# Altium schematic sheet sheet5.SchDoc
size A2
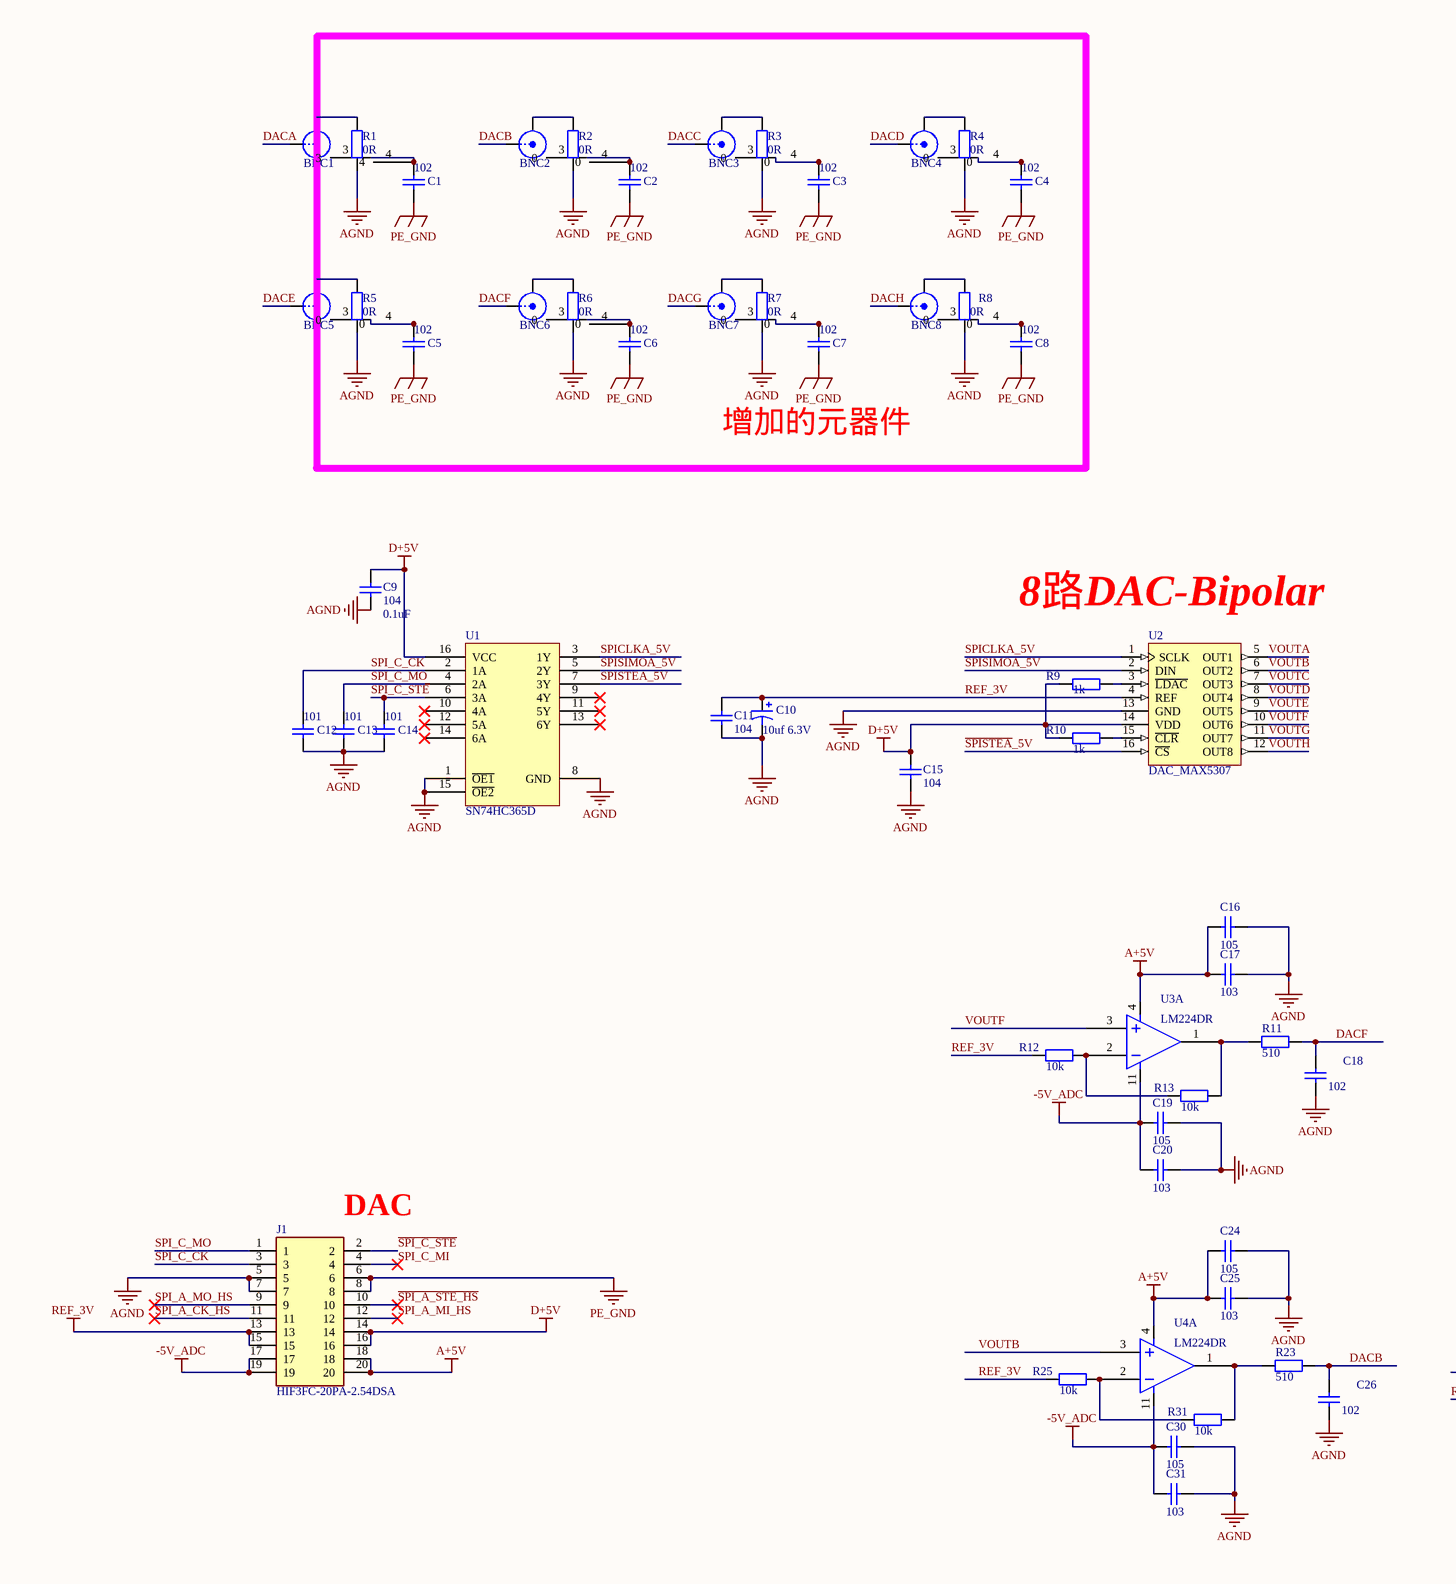
[diagram p0: sheet5.SchDoc, left]
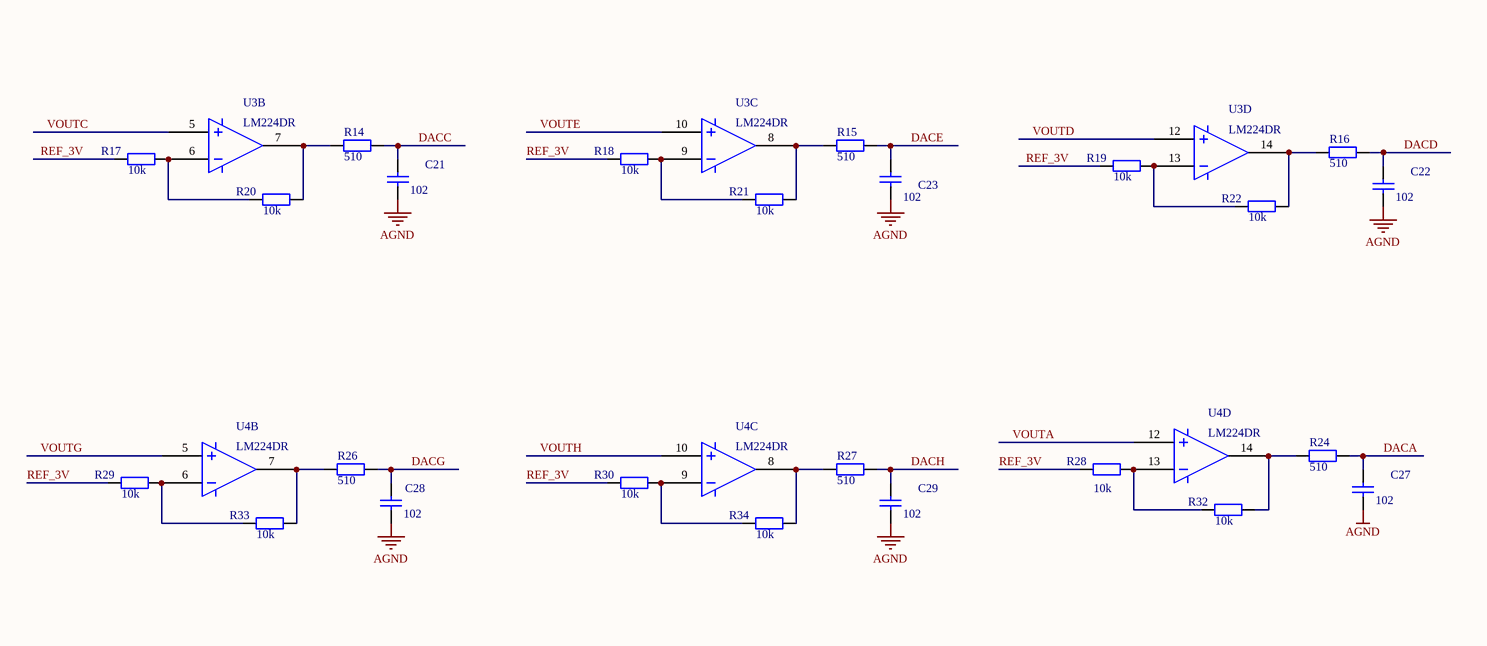
[diagram p1: sheet5.SchDoc, right]

## Parts
BNC1  BNC  [BNC]  (value not drawn)
BNC2  BNC  [BNC]  (value not drawn)
BNC3  BNC  [BNC]  (value not drawn)
BNC4  BNC  [BNC]  (value not drawn)
BNC5  BNC  [BNC]  (value not drawn)
BNC6  BNC  [BNC]  (value not drawn)
BNC7  BNC  [BNC]  (value not drawn)
BNC8  BNC  [BNC]  (value not drawn)
C1  102  [0805]
C2  102  [0805]
C3  102  [0805]
C4  102  [0805]
C5  102  [0805]
C6  102  [0805]
C7  102  [0805]
C8  102  [0805]
C9  104  value 0.1uF  [0805]
C10  10uf 6.3V  [1206 (钽电容)]
C11  104  [0805]
C12  101  [0805]
C13  101  [0805]
C14  101  [0805]
C15  104  [0805]
C16  105  [0805]
C17  103  [0805]
C18  102  [0805]
C19  105  [0805]
C20  103  [0805]
C21  102  [0805]
C22  102  [0805]
C23  102  [0805]
C24  105  [0805]
C25  103  [0805]
C26  102  [0805]
C27  102  [0805]
C28  102  [0805]
C29  102  [0805]
C30  105  [0805]
C31  103  [0805]
J1  HIF3FC-20PA-2.54DSA  [SHDR20W56P254_2X10_3290X850X950P]
R1  0R  [0805]
R2  0R  [0805]
R3  0R  [0805]
R4  0R  [0805]
R5  0R  [0805]
R6  0R  [0805]
R7  0R  [0805]
R8  0R  [0805]
R9  1k  [0805]
R10  1k  [0805]
R11  510  [0805]
R12  10k  [0805]
R13  10k  [0805]
R14  510  [0805]
R15  510  [0805]
R16  510  [0805]
R17  10k  [0805]
R18  10k  [0805]
R19  10k  [0805]
R20  10k  [0805]
R21  10k  [0805]
R22  10k  [0805]
R23  510  [0805]
R24  510  [0805]
R25  10k  [0805]
R26  510  [0805]
R27  510  [0805]
R28  10k  [0805]
R29  10k  [0805]
R30  10k  [0805]
R31  10k  [0805]
R32  10k  [0805]
R33  10k  [0805]
R34  10k  [0805]
U1  SN74HC365D  [D016_N]
U2  DAC_MAX5307  [TSSOP16]
U3  LM224DR  [SOIC14_M]  (parts A,B,C,D of 4)
U4  LM224DR  [SOIC14_M]  (parts A,B,C,D of 4)

## Blocks framed on the sheet
增加的元器件: BNC1-BNC8 C1-C8 R1-R8

## Nets
-5V_ADC: C19.2 C20.1 C30.2 C31.1 J1.17 J1.19 U3.11 U4.11
A+5V: C16.2 C17.1 C24.2 C25.1 J1.18 J1.20 U3.4 U4.4
AGND: C9.2 C10.2 C11.1 C12.2 C13.2 C14.2 C15.1 C16.1 C17.2 C18.2 C19.1 C20.2 C21.2 C22.2 C23.2 C24.1 C25.2 C26.2 C27.2 C28.2 C29.2 C30.1 C31.2 J1.5 J1.7 R1.1 R2.1 R3.1 R4.1 R5.1 R6.1 R7.1 R8.1 U1.1(~{OE1}) U1.8(GND) U1.15(~{OE2}) U2.13(GND)
D+5V: C9.1 C15.2 J1.14 J1.16 R9.1 R10.1 U1.16(VCC) U2.14(VDD)
PE_GND: C1.2 C2.2 C3.2 C4.2 C5.2 C6.2 C7.2 C8.2 J1.6 J1.8
REF_3V: C10.1 C11.2 J1.13 J1.15 R12.1 R17.1 R18.1 R19.1 R25.1 R28.1 R29.1 R30.1 U2.4(REF)
DACA: BNC1.1 C27.1 R24.2
DACB: BNC2.1(X) C26.1 R23.2
DACC: BNC3.1(X) C21.1 R14.2
DACD: BNC4.1(X) C22.1 R16.2
DACE: BNC5.1(X) C23.1 R15.2
DACF: BNC6.1(X) C18.1 R11.2
DACG: BNC7.1(X) C28.1 R26.2
DACH: BNC8.1(X) C29.1 R27.2
~{SPI_A_STE_HS}: J1.10
~{SPI_C_STE}: C14.1 J1.2 U1.6(3A)
~{SPISTEA}_5V: U1.7(3Y) U2.16(~{CS})
SPI_A_CK_HS: J1.11
SPI_A_MI_HS: J1.12
SPI_A_MO_HS: J1.9
SPI_C_CK: C12.1 J1.3 U1.2(1A)
SPI_C_MI: J1.4
SPI_C_MO: C13.1 J1.1 U1.4(2A)
SPICLKA_5V: U1.3(1Y) U2.1(SCLK)
SPISIMOA_5V: U1.5(2Y) U2.2(DIN)
VOUTA: U2.5(OUT1) U4.12
VOUTB: U2.6(OUT2) U4.3
VOUTC: U2.7(OUT3) U3.5
VOUTD: U2.8(OUT4) U3.12
VOUTE: U2.9(OUT5) U3.10
VOUTF: U2.10(OUT6) U3.3
VOUTG: U2.11(OUT7) U4.5
VOUTH: U2.12(OUT8) U4.10
NetBNC1_2: BNC1.2 R1.2
NetBNC1_3: BNC1.3 BNC1.4 C1.1
NetBNC2_2: BNC2.2(Y) R2.2
NetBNC2_3: BNC2.3(0) BNC2.4(0) C2.1
NetBNC3_2: BNC3.2(Y) R3.2
NetBNC3_3: BNC3.3(0) BNC3.4(0) C3.1
NetBNC4_2: BNC4.2(Y) R4.2
NetBNC4_3: BNC4.3(0) BNC4.4(0) C4.1
NetBNC5_2: BNC5.2(Y) R5.2
NetBNC5_3: BNC5.3(0) BNC5.4(0) C5.1
NetBNC6_2: BNC6.2(Y) R6.2
NetBNC6_3: BNC6.3(0) BNC6.4(0) C6.1
NetBNC7_2: BNC7.2(Y) R7.2
NetBNC7_3: BNC7.3(0) BNC7.4(0) C7.1
NetBNC8_2: BNC8.2(Y) R8.2
NetBNC8_3: BNC8.3(0) BNC8.4(0) C8.1
NetR9_2: R9.2 U2.3(~{LDAC})
NetR10_2: R10.2 U2.15(~{CLR})
NetR11_1: R11.1 R13.2 U3.1
NetR12_2: R12.2 R13.1 U3.2
NetR14_1: R14.1 R20.2 U3.7
NetR15_1: R15.1 R21.2 U3.8
NetR16_1: R16.1 R22.2 U3.14
NetR17_2: R17.2 R20.1 U3.6
NetR18_2: R18.2 R21.1 U3.9
NetR19_2: R19.2 R22.1 U3.13
NetR23_1: R23.1 R31.2 U4.1
NetR24_1: R24.1 R32.2 U4.14
NetR25_2: R25.2 R31.1 U4.2
NetR26_1: R26.1 R33.2 U4.7
NetR27_1: R27.1 R34.2 U4.8
NetR28_2: R28.2 R32.1 U4.13
NetR29_2: R29.2 R33.1 U4.6
NetR30_2: R30.2 R34.1 U4.9

Not connected (* = marked no-connect by the designer): U1 9(4Y)* 10(4A)* 11(5Y)* 12(5A)* 13(6Y)* 14(6A)*

## Notes on the sheet
- 8路DAC-Bipolar
- (near J1) DAC

## Library data of the parts
BNC1-BNC8 = BNC: BNC Elbow Connector; LatestRevisionDate: 17-Jul-2002; LatestRevisionNote: Re-released for DXP Platform.; Publisher: Altium Limited
C1-C8 C12-C14 = Cap Semi: Capacitor (Semiconductor SIM Model); Published: 8-Jun-2000; LatestRevisionDate: 17-Jul-2002; LatestRevisionNote: Re-released for DXP Platform.; PackageReference: C1206; Publisher: Altium Limited
C9 C18 C21-C23 C26-C29 = Cap: Capacitor; Published: 8-Jun-2000; LatestRevisionDate: 17-Jul-2002; LatestRevisionNote: Re-released for DXP Platform.; PackageReference: RAD-0.3; Publisher: Altium Limited
C10 = Cap Pol1: Polarized Capacitor (Radial); Published: 8-Jun-2000; LatestRevisionDate: 17-Jul-2002; LatestRevisionNote: Re-released for DXP Platform.; Publisher: Altium Limited
C11 C15-C17 C19 C20 C24 C25 C30 C31 = Cap: Capacitor; Value: 101; Published: 8-Jun-2000; LatestRevisionDate: 17-Jul-2002; LatestRevisionNote: Re-released for DXP Platform.; PackageReference: RAD-0.3; Publisher: Altium Limited
J1 = HIF3FC-20PA-2.54DSA: Connector; Manufacturer_Name: Hirose; Manufacturer_Part_Number: HIF3FC-20PA-2.54DSA(71); Datasheet Link: https://www.hirose.com/product/en/products/HIF3FC/HIF3FC-20PA-2.54DSA%2871%29/; Height: 9.5mm; Mouser Part Number: 798-HIF3FC20PA254D71; Mouser Price/Stock: https://www.mouser.co.uk/ProductDetail/Hirose-Connector/HIF3FC-20PA-254DSA71?qs=eDUdFcBPps3XO21sCrEU%252BQ%3D%3D; Arrow Part Number: HIF3FC-20PA-2.54DSA(71); Arrow Price/Stock: https://www.arrow.com/en/products/hif3fc-20pa-2.54dsa-71/hirose-electric?region=nac; System: Connector
R1-R10 = Res2: Resistor; Value: 10K; Published: 8-Jun-2000; LatestRevisionDate: 17-Jul-2002; LatestRevisionNote: Re-released for DXP Platform.; PackageReference: AXIAL-0.4; Publisher: Altium Limited
R11 R14-R16 R23 R24 R26 R27 = Res2: Resistor; Value: 3.3K; Published: 8-Jun-2000; LatestRevisionDate: 17-Jul-2002; LatestRevisionNote: Re-released for DXP Platform.; PackageReference: AXIAL-0.4; Publisher: Altium Limited; PackageDescription: Axial Device, Thru-Hole; 2 Leads; 0.4 in Pin Spacing
R12 R13 R17-R22 R25 R28-R34 = Res2: Resistor; Published: 8-Jun-2000; LatestRevisionDate: 17-Jul-2002; LatestRevisionNote: Re-released for DXP Platform.; PackageReference: AXIAL-0.4; Publisher: Altium Limited; Value: 10K
U2 = MAX5307: 12-Bit DACs with Serial Interfece; Published: 16-Jan-2001; LatestRevisionDate: 13-Apr-2006; LatestRevisionNote: IPC-7351 Footprint Added.; DatasheetVersion: Sep-1996; PackageReference: WSO16; Publisher: Altium Limited; PackageDescription: 16-Pin Small Outline Integrated Circuit 1.27 mm Pitch; Code_JEDEC: MS-013-AA; Code_IPC: SOIC127P1030-16; ComponentLink1Description: Manufacturer Link; ComponentLink1URL: http://www.maxim-ic.com/; ComponentLink2Description: Datasheet; ComponentLink2URL: http://pdfserv.maxim-ic.com/en/ds/MAX520-MAX521.pdf
U3 U4 = LM124